# EAGLE design EpaperTeensyBoard (EAGLE 7.5.0)
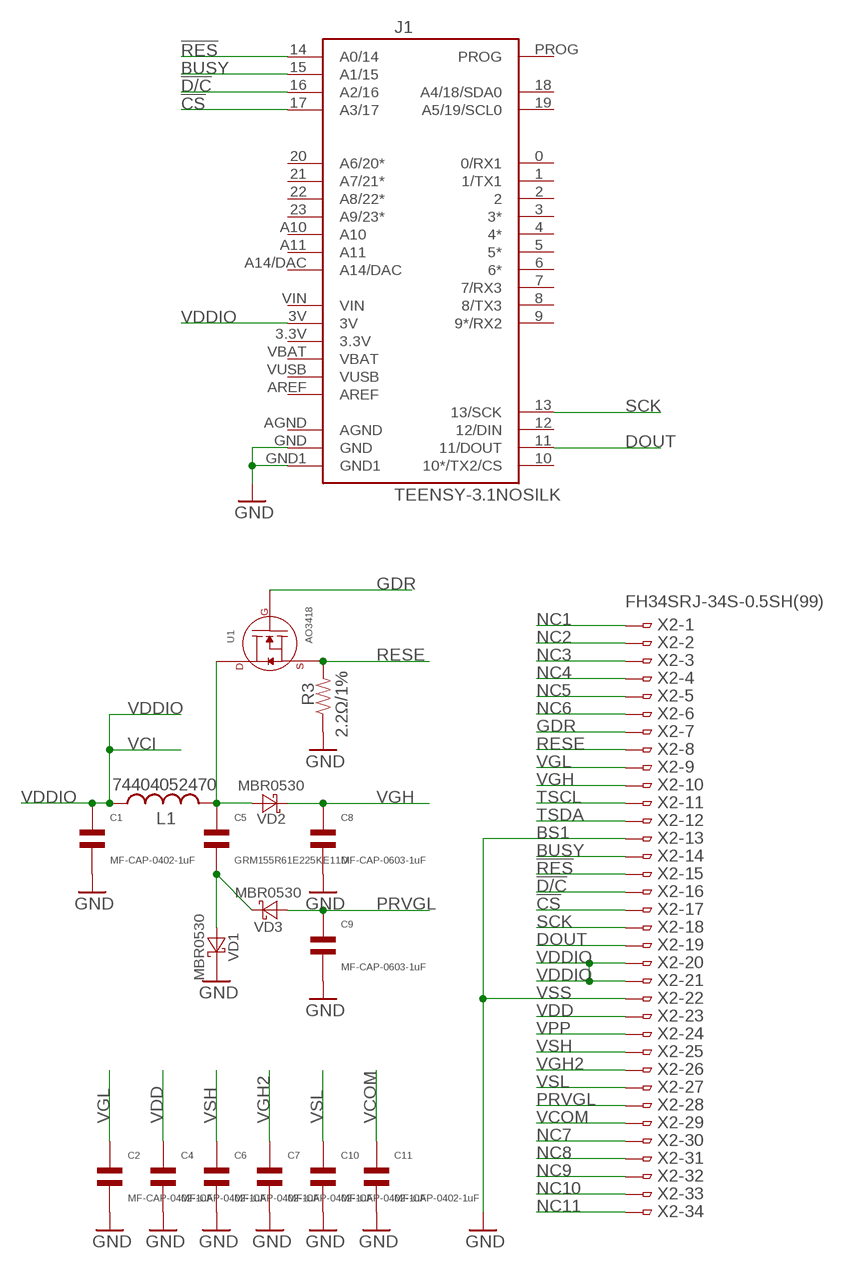
[diagram p0: schematic, sheet 1]

## Parts
C1  MF-CAP-0402-1uF  CAPACITOR_NP_0805  [C0805]
C2  MF-CAP-0402-1uF  CAPACITOR_NP_0805  [C0805]
C4  MF-CAP-0402-1uF  CAPACITOR_NP_0805  [C0805]
C5  GRM155R61E225KE11D  CAPACITOR_NP_0805  [C0805]
C6  MF-CAP-0402-1uF  CAPACITOR_NP_0805  [C0805]
C7  MF-CAP-0402-1uF  CAPACITOR_NP_0805  [C0805]
C8  MF-CAP-0603-1uF  CAPACITOR_NP_0805  [C0805]
C9  MF-CAP-0603-1uF  CAPACITOR_NP_0805  [C0805]
C10  MF-CAP-0402-1uF  CAPACITOR_NP_0805  [C0805]
C11  MF-CAP-0402-1uF  CAPACITOR_NP_0805  [C0805]
J1  TEENSY-3.1NOSILK  [TEENSY-3.1_NOSILK]
L1  74404052470  L-USWE-TPC  [POWER-CHOKE_WE-TPC]
R3  2.2Ω/1%  RESISTOR_0805  [R0805]
U1  AO3418  N-CHANNEL_FET_SOT-23-3  [SOT-23-3]
VD1  MBR0530  DIODE-SCHOTTKY-SOD123  [SOD123]
VD2  MBR0530  DIODE-SCHOTTKY-SOD123  [SOD123]
VD3  MBR0530  DIODE-SCHOTTKY-SOD123  [SOD123]
X2  FH34SRJ-34S-0.5SH(99)  FH12-34S-0.5SH  [FH12-34S-0.5SH]

## Nets
!CS: J1.17(A3/17) X2.17
!D/C: J1.16(A2/16) X2.16
!RES: J1.14(A0/14) X2.15
BUSY: J1.15(A1/15) X2.14
DOUT: J1.11(11/DOUT) X2.19
GDR: U1.P$1(GATE) X2.7
GND [power]: C1.P$2 C2.P$2 C4.P$2 C6.P$2 C7.P$2 C8.P$2 C9.P$2 C10.P$2 C11.P$2 J1.GND J1.GND1 R3.P$1 VD1.C X2.13 X2.22
N$3: C5.P$1 L1.2 U1.P$3(DRAIN) VD2.A
N$6: C5.P$2 VD1.A VD3.C
NC1: X2.1
NC2: X2.2
NC3: X2.3
NC4: X2.4
NC5: X2.5
NC6: X2.6
NC7: X2.30
NC8: X2.31
NC9: X2.32
NC10: X2.33
NC11: X2.34
PRVGL: C9.P$1 VD3.A X2.28
RESE: R3.P$2 U1.P$2(SOURCE) X2.8
SCK: J1.13(13/SCK) X2.18
TSCL: X2.11
TSDA: X2.12
VCOM: C11.P$1 X2.29
VDD: C4.P$1 X2.23
VDDIO: C1.P$1 J1.3V L1.1 X2.20 X2.21
VGH: C8.P$1 VD2.C X2.10
VGH2: C7.P$1 X2.26
VGL: C2.P$1 X2.9
VPP: X2.24
VSH: C6.P$1 X2.25
VSL: C10.P$1 X2.27
Unconnected: J1.0(0/RX1) J1.1(1/TX1) J1.2 J1.3(3*) J1.3.3V J1.4(4*) J1.5(5*) J1.6(6*) J1.7(7/RX3) J1.8(8/TX3) J1.9(9*/RX2) J1.10(10*/TX2/CS) J1.12(12/DIN) J1.18(A4/18/SDA0) J1.19(A5/19/SCL0) J1.20(A6/20*) J1.21(A7/21*) J1.22(A8/22*) J1.23(A9/23*) J1.A10 J1.A11 J1.A14/DAC J1.AGND J1.AREF J1.PROG J1.VBAT J1.VIN J1.VUSB

## Notes on the sheet
- VCI
- BS1
- VSS

## Library data of the parts
C1 C2 C4-C11 = MF_Passives:CAPACITOR_NP: Library: MF_Passives Description: Device for Non-Polarized Capacitors. Manufacture part number (MFG#), Voltage, Temperature Coefficient, and Tolerance can be added via Attributes.; MFG#: N/A; TEMP_COF: N/A; TOLERANCE: N/A; VOLTAGE: N/A
J1 = SparkFun-Boards:TEENSY-3.1; SF_ID: DEV-12646
L1 = rcl:L-US: INDUCTOR, American symbol
R3 = MF_Passives:RESISTOR: Library: MF_Passives Description: Device for Resistors. Manufacture part number (MFG#), Voltage, Tolerance, and Wattage Rating can be added via Attributes.; MFG#: N/A; TOLERANCE: N/A; VOLTAGE: N/A; WATTAGE: N/A
U1 = MF_Discrete_Semiconductor:N-CHANNEL_FET: Library: MF_Discrete_Semiconductor Description: Device for Single N-Channel Mosfet. Manufacture part number (MFG#) can be added via Attributes.
VD1-VD3 = diode:DIODE-SCHOTTKY-: SCHOTTKY DIODE
X2 = con-hirose:FH12-34S-0.5S: 0.5mm Pitch Connectors For FPC/FFC Source: Data sheet <http://www.hirose.co.jp/cataloge_hp/e58605370.pdf>; OC_FARNELL: unknown; OC_NEWARK: unknown

## Net classes
2 power: width 0.203 mm

## Board
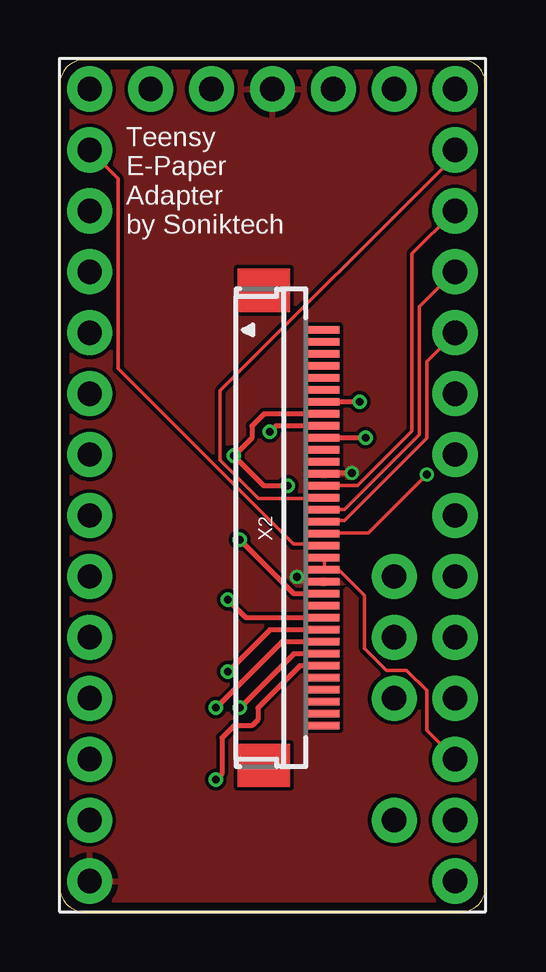
[diagram p1: board, top side]
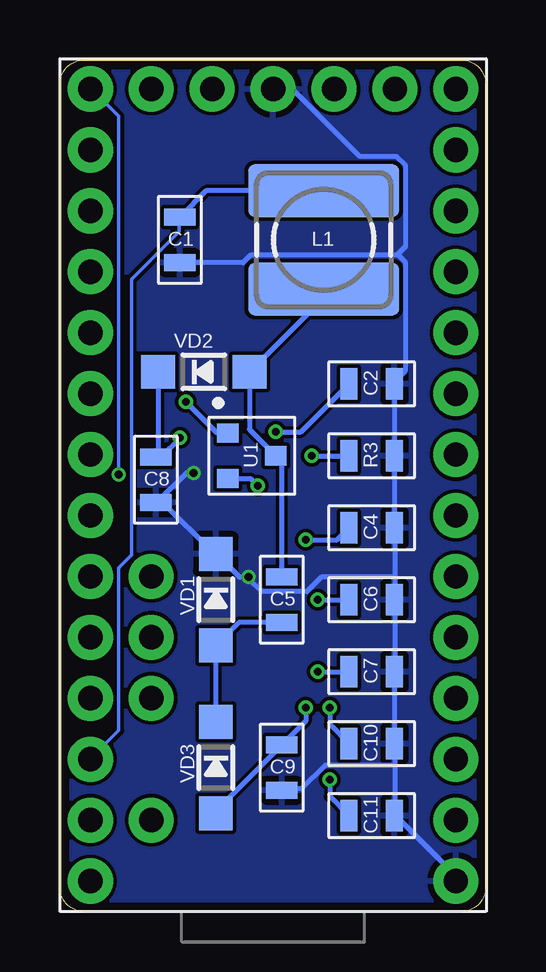
[diagram p2: board, bottom side, seen from below]

Size 17.75 x 35.5 mm. Coordinates in mm from the lower left corner, seen from the top.
Outline: 0,34.5 0,1 arc90 1,0 16.75,0 arc90 17.75,1 17.75,34.5 arc90 16.75,35.5 1,35.5 arc90 0,34.5
Copper layers (1*16): Top 0.0356mm / dielectric 1.5011mm / Bottom 0.0356mm
Design rules "OSHparkDruTented": minimum track width 6mil, minimum drill 13mil, track to track 6mil, track to pad 6mil, pad to pad 6mil, via to via 6mil, smd to smd 5mil, copper to edge 15mil, drill to drill 6mil, minimum pad ring 5mil, minimum via ring 5mil, stop-mask expansion 3mil, vias tented up to drill 14mil, thermal gap 10mil

### Footprints (pad centres in the part's own frame; a part is rotated, then mirrored left to right if it is on the bottom)
C0805 = smd 0.7 x 1.3: P$1 -0.95,0; P$2 0.95,0
TEENSY-3.1_NOSILK = drill 1.016 pad 1.88: 0 16.51,3.81; 1 16.51,6.35; 2 16.51,8.89; 3 16.51,11.43; 3.3V 11.43,34.29; 3V 1.27,6.35; 4 16.51,13.97; 5 16.51,16.51; 6 16.51,19.05; 7 16.51,21.59; 8 16.51,24.13; 9 16.51,26.67; 10 16.51,29.21; 11 16.51,31.75; 12 16.51,34.29; 13 1.27,34.29; 14 1.27,31.75; 15 1.27,29.21; 16 1.27,26.67; 17 1.27,24.13; 18 1.27,21.59; 19 1.27,19.05; 20 1.27,16.51; 21 1.27,13.97; 22 1.27,11.43; 23 1.27,8.89; A10 3.81,11.43; A11 3.81,13.97; A14/DAC 3.81,34.29; AGND 1.27,3.81; AREF 3.81,8.89; GND 8.89,34.29; GND1 16.51,1.27; PROG 6.35,34.29; VBAT 13.97,34.29; VIN 1.27,1.27; VUSB 3.81,3.81
POWER-CHOKE_WE-TPC = smd 6.3 x 2.2: 1 0,2.05; 2 0,-2.05
R0805 = smd 0.7 x 1.3: P$1 -0.95,0; P$2 0.95,0
SOT-23-3 = smd 0.8 x 0.9: P$1 -0.95,-1; P$2 0.95,-1; P$3 0,1
SOD123 = smd 1.4 x 1.4: A 1.905,0; C -1.905,0
FH12-34S-0.5SH = smd 0.3 x 1.3: 1 -8.25,3.25; 2 -7.75,3.25; 3 -7.25,3.25; 4 -6.75,3.25; 5 -6.25,3.25; 6 -5.75,3.25; 7 -5.25,3.25; 8 -4.75,3.25; 9 -4.25,3.25; 10 -3.75,3.25; 11 -3.25,3.25; 12 -2.75,3.25; 13 -2.25,3.25; 14 -1.75,3.25; 15 -1.25,3.25; 16 -0.75,3.25; 17 -0.25,3.25; 18 0.25,3.25; 19 0.75,3.25; 20 1.25,3.25; 21 1.75,3.25; 22 2.25,3.25; 23 2.75,3.25; 24 3.25,3.25; 25 3.75,3.25; 26 4.25,3.25; 27 4.75,3.25; 28 5.25,3.25; 29 5.75,3.25; 30 6.25,3.25; 31 6.75,3.25; 32 7.25,3.25; 33 7.75,3.25; 34 8.25,3.25

### Placement (x,y rotation side)
C1  12.75,28 270 bottom
C2  4.75,22 0 bottom
C4  4.75,16 0 bottom
C5  8.5,13 270 bottom
C6  4.75,13 0 bottom
C7  4.75,10 0 bottom
C8  13.75,18 270 bottom
C9  8.5,6 270 bottom
C10  4.75,7 0 bottom
C11  4.75,4 0 bottom
J1  17.75,0 0 bottom
L1  6.75,28 0 bottom
R3  4.75,19 180 bottom
U1  9.75,19 270 bottom
VD1  11.25,13 270 bottom
VD2  11.75,22.5 0 bottom
VD3  11.25,6 270 bottom
X2  7.75,16 270 top

### Tracks (layer width: path | path; a pad name or v marks a point on that pad's centre or on a via)
!CS
  Top 0.152: X2.17 11.03,16.31 11.87,16.31 15.29,19.74 15.29,22.94 16.44,24.08 J1.17
!D/C
  Top 0.152: X2.16 11.03,16.76 11.87,16.76 14.99,19.89 14.99,25.22 16.44,26.67 J1.16
!RES
  Top 0.152: X2.15 10.95,17.22 8.28,17.22 6.68,18.82 6.68,21.72 16.44,31.47 16.44,31.7 J1.14
BUSY
  Top 0.152: X2.14 11.03,17.75 12.4,17.75 14.69,20.04 14.69,27.43 16.44,29.18 J1.15
DOUT
  Top 0.152: X2.19 10.95,15.32 9.73,15.32 2.42,22.63 2.42,30.56 1.27,31.7 J1.11
GDR  (via drill 0.33)
  Top 0.203: v12.5,21.25 X2.7
  Bottom 0.203: U1.P$1 11.2,19.95 v12.5,21.25
GND  (via drill 0.33)
  Top 0.203: v9.88,13.95 10.04,13.79 10.95,13.79 X2.22 | v12.17,18.29 11.03,18.29 X2.13
  Bottom 0.203: 3.79,6.1 3.79,6.93 C10.P$2 3.79,7.09 3.79,9.98 C7.P$2 3.79,10.06 3.79,12.95 C6.P$2 3.79,13.03 3.79,13.95 | 3.79,6.1 3.79,4.04 C11.P$2 3.71,3.96 1.27,1.52 1.27,1.29 J1.GND1 | 3.79,6.1 6.68,6.1 7.67,5.11 8.44,5.11 C9.P$2 | v12.17,18.29 12.47,18.29 13.7,17.07 C8.P$2 13.54,17.14 11.33,14.94 VD1.C 11.18,14.86 10.27,13.95 v9.88,13.95 9.88,13.87 9.35,13.34 7.45,13.34 6.84,13.95 3.79,13.95 | 3.79,13.95 3.79,15.93 C4.P$2 3.79,16.08 3.79,18.97 R3.P$1 3.79,19.05 3.79,21.95 C2.P$2 3.79,22.1 3.33,22.55 3.33,27.05 3.64,27.36 | 3.64,27.36 9.81,27.36 10.11,27.05 12.7,27.05 C1.P$2 | J1.GND 8.06,34.29 5.24,31.47 3.71,31.47 3.33,31.09 3.33,27.74 3.64,27.43 3.64,27.36
  pour Bottom: -0.25,0 17.75,0 17.75,35 17.75,36 -0.25,36
  pour Top: -0.25,0 17.75,0 17.75,35 17.75,36 -0.25,36
N$3
  Bottom 0.203: C5.P$1 8.5,18.75 U1.P$3 9.85,20.09 VD2.A 6.75,25.59 L1.2
N$6
  Bottom 0.203: VD3.C VD1.A 10.29,12.05 C5.P$2
PRVGL  (via drill 0.33)
  Top 0.203: X2.28 9.75,10.75 v7.5,8.5
  Bottom 0.203: VD3.A 11.25,4.2 C9.P$1 7.5,7.95 v7.5,8.5
RESE  (via drill 0.33)
  Top 0.203: X2.8 8.5,20.75 8,20.25 8,19.75 v7.25,19 8.5,17.75 v9.5,17.75
  Bottom 0.203: v7.25,19 R3.P$2 | U1.P$2 9.8,18.05 v9.5,17.75
SCK  (via drill 0.33)
  Top 0.152: v15.29,18.21 12.86,15.77 11.03,15.77 X2.18
  Bottom 0.152: v15.29,18.21 15.29,33.15 16.44,34.29 J1.13
VCOM  (via drill 0.33)
  Top 0.203: X2.29 10,10.25 8.25,8.5 8.25,8 8,7.75 7.25,7.75 6.75,7.25 6.75,5.75 v6.5,5.5
  Bottom 0.203: v6.5,5.5 6.5,4.8 C11.P$1
VDD  (via drill 0.33)
  Top 0.203: X2.23 9.75,13.25 v7.5,15.5
  Bottom 0.203: v7.5,15.5 6.2,15.5 C4.P$1
VDDIO
  Top 0.152: X2.20 11.03,14.71 11.03,14.33 X2.21 11.1,14.33 11.56,14.33 12.7,13.18 12.7,10.97 13.62,10.06 14.46,10.06 15.29,9.22 15.29,7.54 16.44,6.4 J1.3V
  Bottom 0.152: C1.P$1 12.78,28.88 12.78,28.35 14.76,26.36 14.76,14.86 15.29,14.33 15.29,7.54 16.44,6.4 J1.3V
  Bottom 0.203: L1.1 11.65,30.05 C1.P$1
VGH  (via drill 0.33)
  Top 0.203: v12.75,19.75 X2.10
  Bottom 0.203: VD2.C 13.65,19.05 C8.P$1 13.55,18.95 v12.75,19.75
VGH2  (via drill 0.33)
  Top 0.203: X2.26 8.75,11.75 v7,10
  Bottom 0.203: v7,10 C7.P$1
VGL  (via drill 0.33)
  Top 0.203: X2.9 9,20.25 v8.75,20
  Bottom 0.203: v8.75,20 7.7,20 C2.P$1
VSH  (via drill 0.33)
  Top 0.203: X2.25 7.75,12.25 v7,13
  Bottom 0.203: v7,13 C6.P$1
VSL  (via drill 0.33)
  Top 0.203: X2.27 9.25,11.25 v6.5,8.5
  Bottom 0.203: v6.5,8.5 6.5,7.8 C10.P$1

### Text on the board
tNames: Teensy / E-Paper / Adapter / by Soniktech